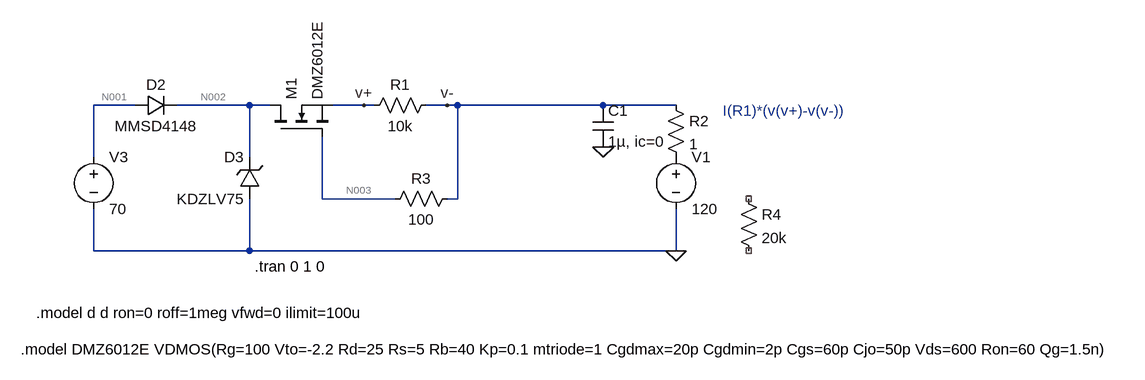
[diagram p0: schematic LD Pin reverse polarity protection.asc]
LD Pin reverse polarity protection.asc, the LTspice schematic file:
Version 4
SHEET 1 916 680
WIRE -272 80 -336 80
WIRE -96 80 -208 80
WIRE -64 80 -96 80
WIRE 80 80 32 80
WIRE 96 80 80 80
WIRE 208 80 176 80
WIRE 224 80 208 80
WIRE 448 80 224 80
WIRE 560 80 448 80
WIRE -336 160 -336 80
WIRE -96 160 -96 80
WIRE 16 224 16 128
WIRE 128 224 16 224
WIRE 224 224 224 80
WIRE 224 224 208 224
WIRE -336 304 -336 240
WIRE -96 304 -96 224
WIRE -96 304 -336 304
WIRE 560 304 560 240
WIRE 560 304 -96 304
FLAG 560 304 0
FLAG 80 80 v+
FLAG 208 80 v-
FLAG 448 144 0
SYMBOL res 80 96 R270
WINDOW 0 32 56 VTop 2
WINDOW 3 0 56 VBottom 2
SYMATTR InstName R1
SYMATTR Value 10k
SYMBOL res 544 64 R0
SYMATTR InstName R2
SYMATTR Value 1
SYMBOL nmos -64 128 R270
SYMATTR InstName M1
SYMATTR Value DMZ6012E
SYMBOL res 224 208 R90
WINDOW 0 0 56 VBottom 2
WINDOW 3 32 56 VTop 2
SYMATTR InstName R3
SYMATTR Value 100
SYMBOL cap 432 80 R0
SYMATTR InstName C1
SYMATTR Value 1µ, ic=0
SYMBOL voltage 560 144 R0
WINDOW 123 0 0 Left 0
WINDOW 39 0 0 Left 0
SYMATTR InstName V1
SYMATTR Value 120
SYMBOL res 656 208 R0
SYMATTR InstName R4
SYMATTR Value 20k
SYMBOL voltage -336 144 R0
WINDOW 123 0 0 Left 0
WINDOW 39 0 0 Left 0
SYMATTR InstName V3
SYMATTR Value 70
SYMBOL diode -272 96 R270
WINDOW 0 32 32 VTop 2
WINDOW 3 0 32 VBottom 2
SYMATTR InstName D2
SYMATTR Value MMSD4148
SYMBOL zener -80 224 R180
WINDOW 0 24 64 Left 2
WINDOW 3 24 0 Left 2
SYMATTR InstName D3
SYMATTR Value KDZLV75
SYMATTR Description Diode
SYMATTR Type diode
TEXT -88 328 Left 2 !.tran 0 1 0
TEXT 632 88 Left 2 ;I(R1)*(v(v+)-v(v-))
TEXT -424 400 Left 2 !.model d d ron=0 roff=1meg vfwd=0 ilimit=100u
TEXT -448 456 Left 2 !.model DMZ6012E VDMOS(Rg=100 Vto=-2.2 Rd=25 Rs=5 Rb=40 Kp=0.1 mtriode=1 Cgdmax=20p Cgdmin=2p Cgs=60p Cjo=50p Vds=600 Ron=60 Qg=1.5n)

The netlist it stands for:
* LD Pin reverse polarity protection.asc
R1 v+ v- 10k
R2 v- P001 1
M1 N002 N003 v+ v+ DMZ6012E
R3 v- N003 100
C1 v- 0 1µ, ic=0
V1 P001 0 120
R4 NC_01 NC_02 20k
V3 N001 0 70
D2 N001 N002 MMSD4148
D3 0 N002 KDZLV75
.model D D
.lib standard.dio
.model NMOS NMOS
.model PMOS PMOS
.lib standard.mos
.tran 0 1 0
* I(R1)*(v(v+)-v(v-))
.model d d ron=0 roff=1meg vfwd=0 ilimit=100u
.model DMZ6012E VDMOS(Rg=100 Vto=-2.2 Rd=25 Rs=5 Rb=40 Kp=0.1 mtriode=1 Cgdmax=20p Cgdmin=2p Cgs=60p Cjo=50p Vds=600 Ron=60 Qg=1.5n)
.backanno
.end

* Results of the author's LTspice run, read from the files saved beside the schematic
* Operating Point, zero values left out:
*   V(v+) = 2.253 V
*   V(v-) = 119.9 mV
*   V(p001) = 120 V
*   V(n002) = 69.15 V
*   V(n003) = 119.9 mV
*   V(n001) = 70 V
*   Id(M1) = 213.4 µA
*   Is(M1) = -213.4 µA
*   I(C1) = 119.9 A
*   I(D3) = -96.71 pA
*   I(D2) = 213.4 µA
*   I(R2) = -119.9 A
*   I(R1) = 213.4 µA
*   I(V3) = -213.4 µA
*   I(V1) = -119.9 A
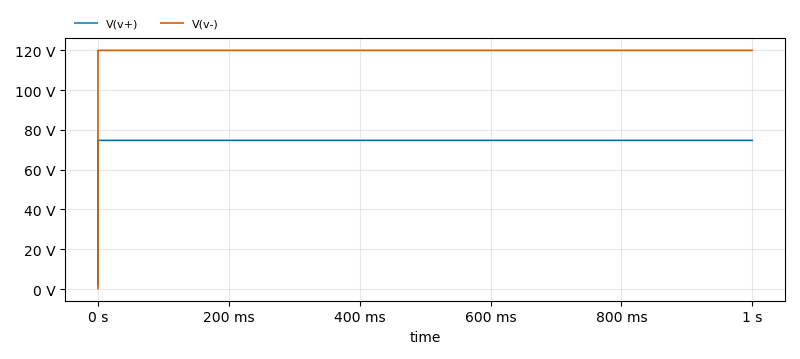
[diagram p1: Transient Analysis of LD Pin reverse polarity protection.asc, plotted from the saved traces]
* Transient Analysis, 1 run:
*   V(v+): min 2.253 V, max 74.75 V, average 74.75 V, rms 74.75 V, last 74.75 V
*   V(v-): min 119.9 mV, max 120 V, average 120 V, rms 120 V, last 120 V